# EAGLE design Rev1_6 (EAGLE 9.0.1)
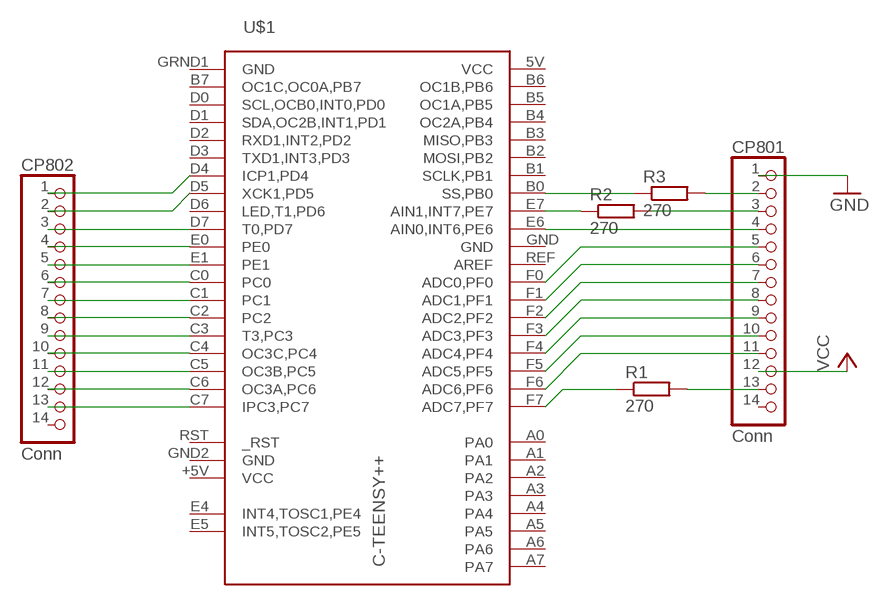
[diagram p0: schematic, sheet 1]

## Parts
CP801  Conn  PINHD-1X14  [1X14]
CP802  Conn  PINHD-1X14  [1X14]
R1  270  R-EU_R0805  [R0805]
R2  270  R-EU_R0805  [R0805]
R3  270  R-EU_R0805  [R0805]
U$1  C-TEENSY++  [TEENSY++]

## Nets
GND [GND]: CP801.1
N$1: CP801.11 U$1.F6(ADC6,PF6)
N$2: CP802.13 U$1.C7(IPC3,PC7)
N$3: CP801.10 U$1.F5(ADC5,PF5)
N$4: CP801.9 U$1.F4(ADC4,PF4)
N$5: CP801.8 U$1.F3(ADC3,PF3)
N$6: CP801.7 U$1.F2(ADC2,PF2)
N$7: CP801.6 U$1.F1(ADC1,PF1)
N$8: CP801.5 U$1.F0(ADC0,PF0)
N$9: CP801.4 U$1.E6(AIN0,INT6,PE6)
N$10: CP802.12 U$1.C6(OC3A,PC6)
N$11: CP802.11 U$1.C5(OC3B,PC5)
N$12: CP802.10 U$1.C4(OC3C,PC4)
N$13: CP802.9 U$1.C3(T3,PC3)
N$14: CP802.8 U$1.C2
N$15: CP802.7 U$1.C1
N$16: CP802.6 U$1.C0
N$17: CP802.5 U$1.E1
N$18: CP802.4 U$1.E0
N$19: CP802.3 U$1.D7(T0,PD7)
N$20: CP802.2 U$1.D5(XCK1,PD5)
N$21: CP802.1 U$1.D4(ICP1,PD4)
N$22: CP801.3 R2.2
N$23: R2.1 U$1.E7(AIN1,INT7,PE7)
N$24: R3.1 U$1.B0(SS,PB0)
N$25: CP801.2 R3.2
N$26: R1.1 U$1.F7(ADC7,PF7)
N$27: CP801.13 R1.2
VCC [VCC]: CP801.12
Unconnected: CP801.14 CP802.14 U$1.A0 U$1.A1 U$1.A2 U$1.A3 U$1.A4 U$1.A5 U$1.A6 U$1.A7 U$1.B1(SCLK,PB1) U$1.B2(MOSI,PB2) U$1.B3(MISO,PB3) U$1.B4(OC2A,PB4) U$1.B5(OC1A,PB5) U$1.B6(OC1B,PB6) U$1.B7(OC1C,OC0A,PB7) U$1.D0(SCL,OCB0,INT0,PD0) U$1.D1(SDA,OC2B,INT1,PD1) U$1.D2(RXD1,INT2,PD2) U$1.D3(TXD1,INT3,PD3) U$1.D6(LED,T1,PD6) U$1.E4(INT4,TOSC1,PE4) U$1.E5(INT5,TOSC2,PE5) U$1.REF(AREF) U$1.RST(_RST)

## Power pins joined to a net without a drawn wire
GND: U$1.GND U$1.GND2(GND) U$1.GRND1(GND)
VCC: U$1.5V(VCC) U$1.+5V(VCC)

## Library data of the parts
CP801 CP802 = pinhead:PINHD-1X14: PIN HEADER
R1-R3 = resistor:R-EU_: RESISTOR, European symbol
U$1 = teensypp:C-TEENSY++

## Net classes
0 default: width 0.203 mm
1 VCC: width 0.305 mm
2 GND: width 0.305 mm

## Board
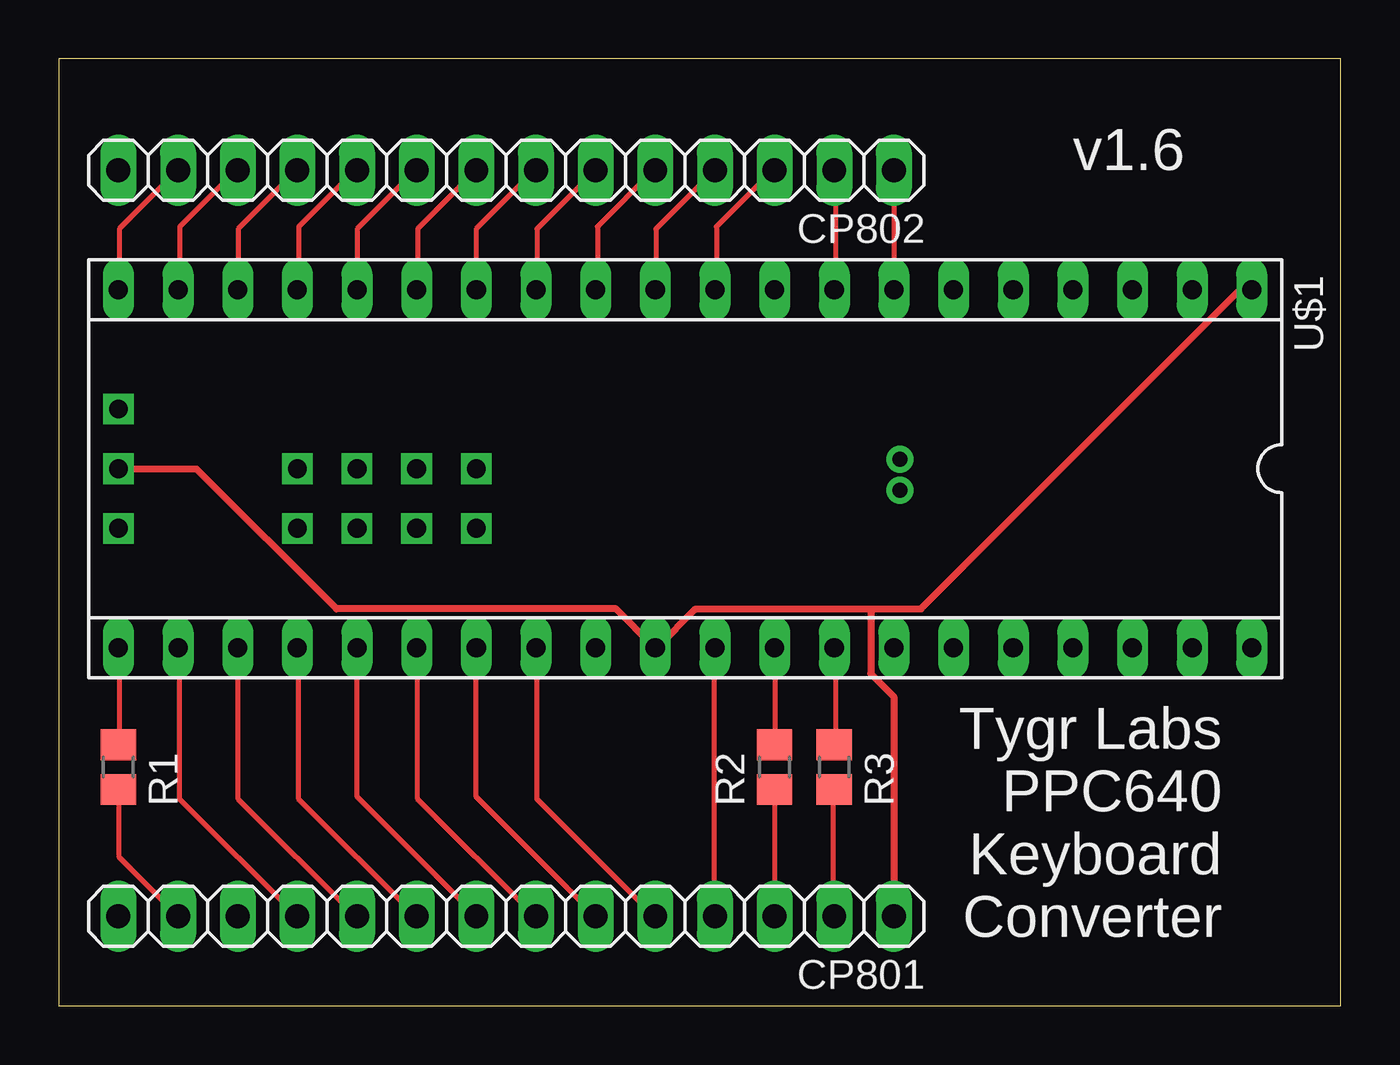
[diagram p1: board, top side]
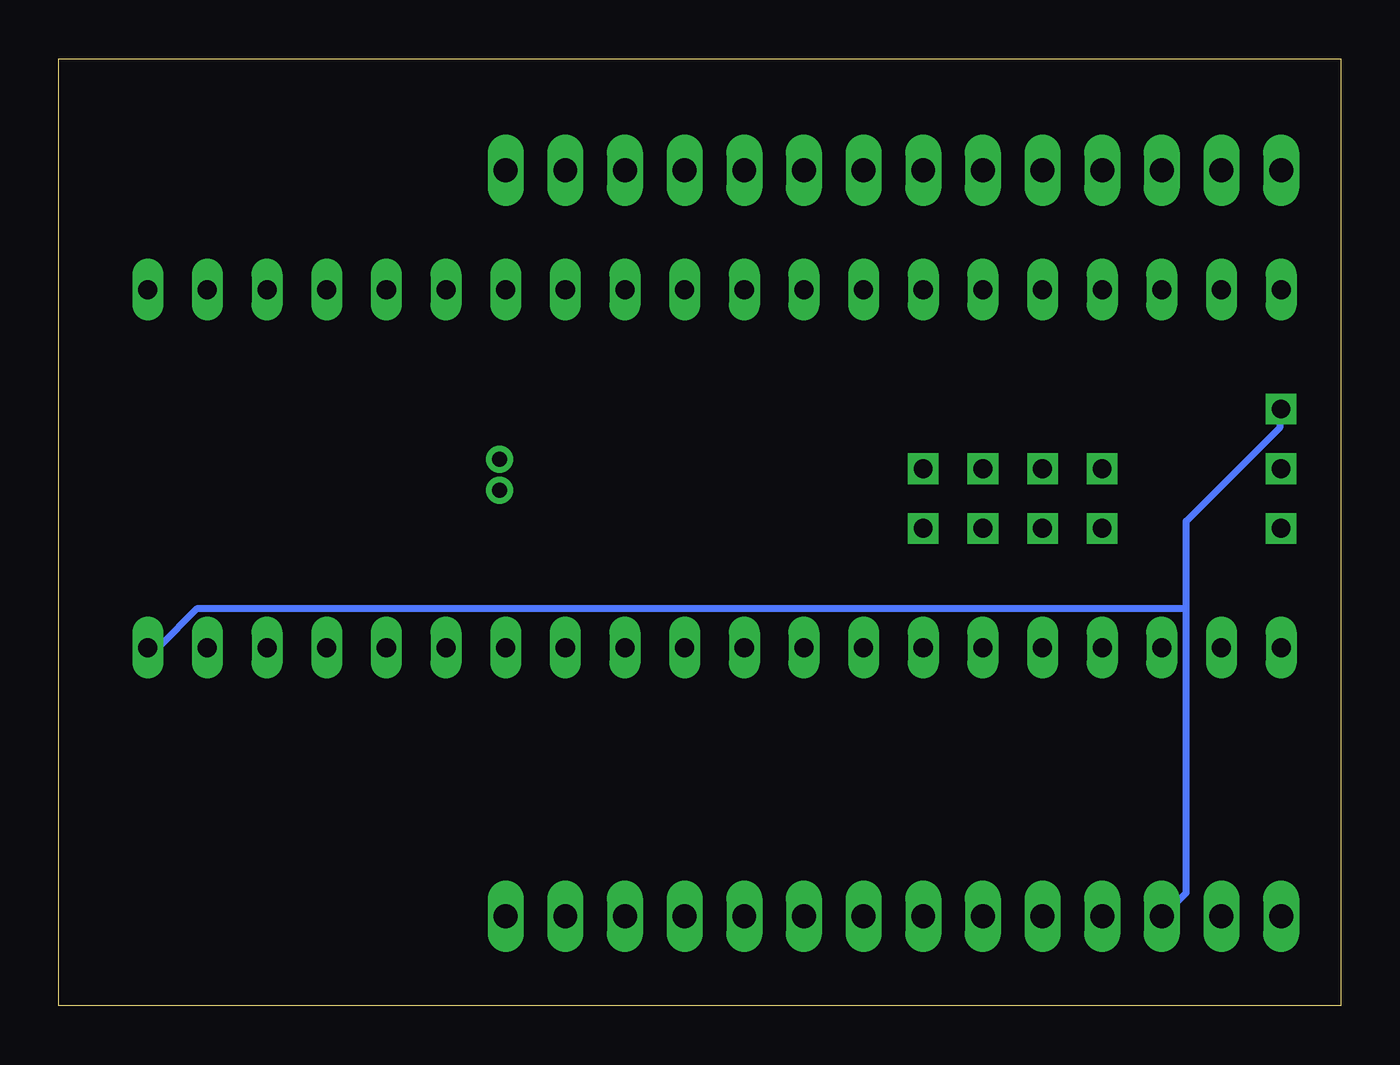
[diagram p2: board, bottom side, seen from below]

Size 54.59 x 40.31 mm. Coordinates in mm from the lower left corner, seen from the top.
Outline: 0,0 54.59,0 54.59,40.31 0,40.31 0,0
Copper layers (1*16): Top 0.035mm / dielectric 1.5mm / Bottom 0.035mm
Design rules "default": minimum track width 6mil, minimum drill 0.35mm, track to track 6mil, track to pad 6mil, pad to pad 6mil, via to via 6mil, smd to smd 6mil, copper to edge 40mil, drill to drill 6mil, minimum pad ring 10mil, minimum via ring 8mil, stop-mask expansion 4mil, vias tented up to drill 0mil, thermal gap 10mil

### Footprints (pad centres in the part's own frame; a part is rotated, then mirrored left to right if it is on the bottom)
1X14 = drill 1.016 long: 1 -16.51,0; 2 -13.97,0; 3 -11.43,0; 4 -8.89,0; 5 -6.35,0; 6 -3.81,0; 7 -1.27,0; 8 1.27,0; 9 3.81,0; 10 6.35,0; 11 8.89,0; 12 11.43,0; 13 13.97,0; 14 16.51,0
R0805 = smd 1.3 x 1.5: 1 -0.95,0; 2 0.95,0
TEENSY++ = drill 0.8 square: 5V 24.13,-2.54; A0 8.89,0; A1 11.43,0; A2 13.97,0; A3 16.51,0; A4 8.89,2.54; A5 11.43,2.54; A6 13.97,2.54; A7 16.51,2.54; GND2 24.13,0; RST 24.13,2.54 | drill 0.813 long: +5V -24.13,7.62; B0 -6.35,7.62; B1 -8.89,7.62; B2 -11.43,7.62; B3 -13.97,7.62; B4 -16.51,7.62; B5 -19.05,7.62; B6 -21.59,7.62; B7 -21.59,-7.62; C0 6.35,-7.62; C1 8.89,-7.62; C2 11.43,-7.62; C3 13.97,-7.62; C4 16.51,-7.62; C5 19.05,-7.62; C6 21.59,-7.62; C7 24.13,-7.62; D0 -19.05,-7.62; D1 -16.51,-7.62; D2 -13.97,-7.62; D3 -11.43,-7.62; D4 -8.89,-7.62; D5 -6.35,-7.62; D6 -3.81,-7.62; D7 -1.27,-7.62; E0 1.27,-7.62; E1 3.81,-7.62; E6 -1.27,7.62; E7 -3.81,7.62; F0 6.35,7.62; F1 8.89,7.62; F2 11.43,7.62; F3 13.97,7.62; F4 16.51,7.62; F5 19.05,7.62; F6 21.59,7.62; F7 24.13,7.62; GND -24.13,-7.62; GRND1 1.27,7.62; REF 3.81,7.62 | drill 0.635 pad 1.067: E4 -9.144,0.914; E5 -9.144,-0.406

### Placement (x,y rotation side)
CP801  19.05,3.81 180 top
CP802  19.05,35.56 180 top
R1  2.54,10.16 270 top
R2  30.48,10.16 270 top
R3  33.02,10.16 270 top
U$1  26.67,22.86 180 top

### Tracks (layer width: path | path; a pad name or v marks a point on that pad's centre or on a via)
GND
  Top 0.305: U$1.GND2 2.58,22.85 5.87,22.85 11.82,16.89 23.74,16.89 25.34,15.29 U$1.GRND1 25.51,15.29 27.11,16.89 34.58,16.89 | 34.58,16.89 36.72,16.89 50.23,30.4 50.76,30.4 U$1.GND | CP801.1 35.56,13.16 34.58,14.13 34.58,16.89
N$1
  Top 0.203: U$1.F6 5.16,15.2 5.16,8.8 10.13,3.82 CP801.11
N$2
  Top 0.203: U$1.C7 2.58,30.49 2.58,33.07 5.07,35.56 CP802.13
N$3
  Top 0.203: U$1.F5 7.64,15.2 7.64,8.8 12.62,3.82 CP801.10
N$4
  Top 0.203: U$1.F4 10.22,15.2 10.22,8.8 15.2,3.82 CP801.9
N$5
  Top 0.203: U$1.F3 12.71,15.2 12.71,8.89 17.78,3.82 CP801.8
N$6
  Top 0.203: U$1.F2 15.29,15.2 15.29,8.8 20.27,3.82 CP801.7
N$7
  Top 0.203: U$1.F1 17.78,8.89 CP801.6
N$8
  Top 0.203: U$1.F0 20.36,15.2 20.36,8.8 25.34,3.82 CP801.5
N$9
  Top 0.203: U$1.E6 27.91,15.2 27.91,3.82 CP801.4
N$10
  Top 0.203: U$1.C6 5.16,30.49 5.16,33.16 7.56,35.56 CP802.12
N$11
  Top 0.203: U$1.C5 7.64,30.49 7.64,33.07 10.13,35.56 CP802.11
N$12
  Top 0.203: U$1.C4 10.22,30.49 10.22,33.16 12.62,35.56 CP802.10
N$13
  Top 0.203: U$1.C3 12.71,30.49 12.71,33.07 15.2,35.56 CP802.9
N$14
  Top 0.203: CP802.8 15.29,33.07 15.29,30.49 U$1.C2
N$15
  Top 0.203: U$1.C1 17.78,33.07 20.27,35.56 CP802.7
N$16
  Top 0.203: U$1.C0 20.36,30.49 20.36,33.07 22.85,35.56 CP802.6
N$17
  Top 0.203: U$1.E1 22.94,30.49 22.94,33.16 25.34,35.56 CP802.5
N$18
  Top 0.203: U$1.E0 25.43,30.49 25.43,33.07 27.91,35.56 CP802.4
N$19
  Top 0.203: U$1.D7 28,30.49 28,33.16 30.4,35.56 CP802.3
N$20
  Top 0.203: U$1.D5 33.07,30.49 33.07,35.56 CP802.2
N$21
  Top 0.203: CP802.1 U$1.D4
N$22
  Top 0.203: 30.49,9.16 R2.2 30.49,9.07 30.49,3.82 CP801.3
N$23
  Top 0.203: 30.49,11.11 R2.1 30.49,11.2 30.49,15.2 U$1.E7
N$24
  Top 0.203: 33.07,11.11 R3.1 33.07,11.2 33.07,15.2 U$1.B0
N$25
  Top 0.203: 32.98,9.16 R3.2 32.98,9.07 32.98,3.82 CP801.2
N$26
  Top 0.203: R1.1 2.58,11.11 2.58,15.2 U$1.F7
N$27
  Top 0.203: CP801.13 2.58,6.31 2.58,9.16 R1.2
VCC
  Bottom 0.305: 6.58,16.89 6.58,4.8 7.56,3.82 CP801.12 | 6.58,16.89 6.58,20.62 2.58,24.62 2.58,25.34 U$1.5V | 6.58,16.89 48.72,16.89 50.32,15.29 50.76,15.29 U$1.+5V

### Text on the board
tPlace: v1.6
tNames: Tygr Labs / PPC640 / Keyboard / Converter